# EasyEDA Pro project 生命体征.eprj

# Schematic Schematic1
Board Name: Board1; Create Date: 2025-03-21; Page Name: P1; Project Name: 生命体征; Schematic Name: Schematic1; Update Date: 2025-04-06; Company: 嘉立创EDA; Page Size: A4; Version: V1.0
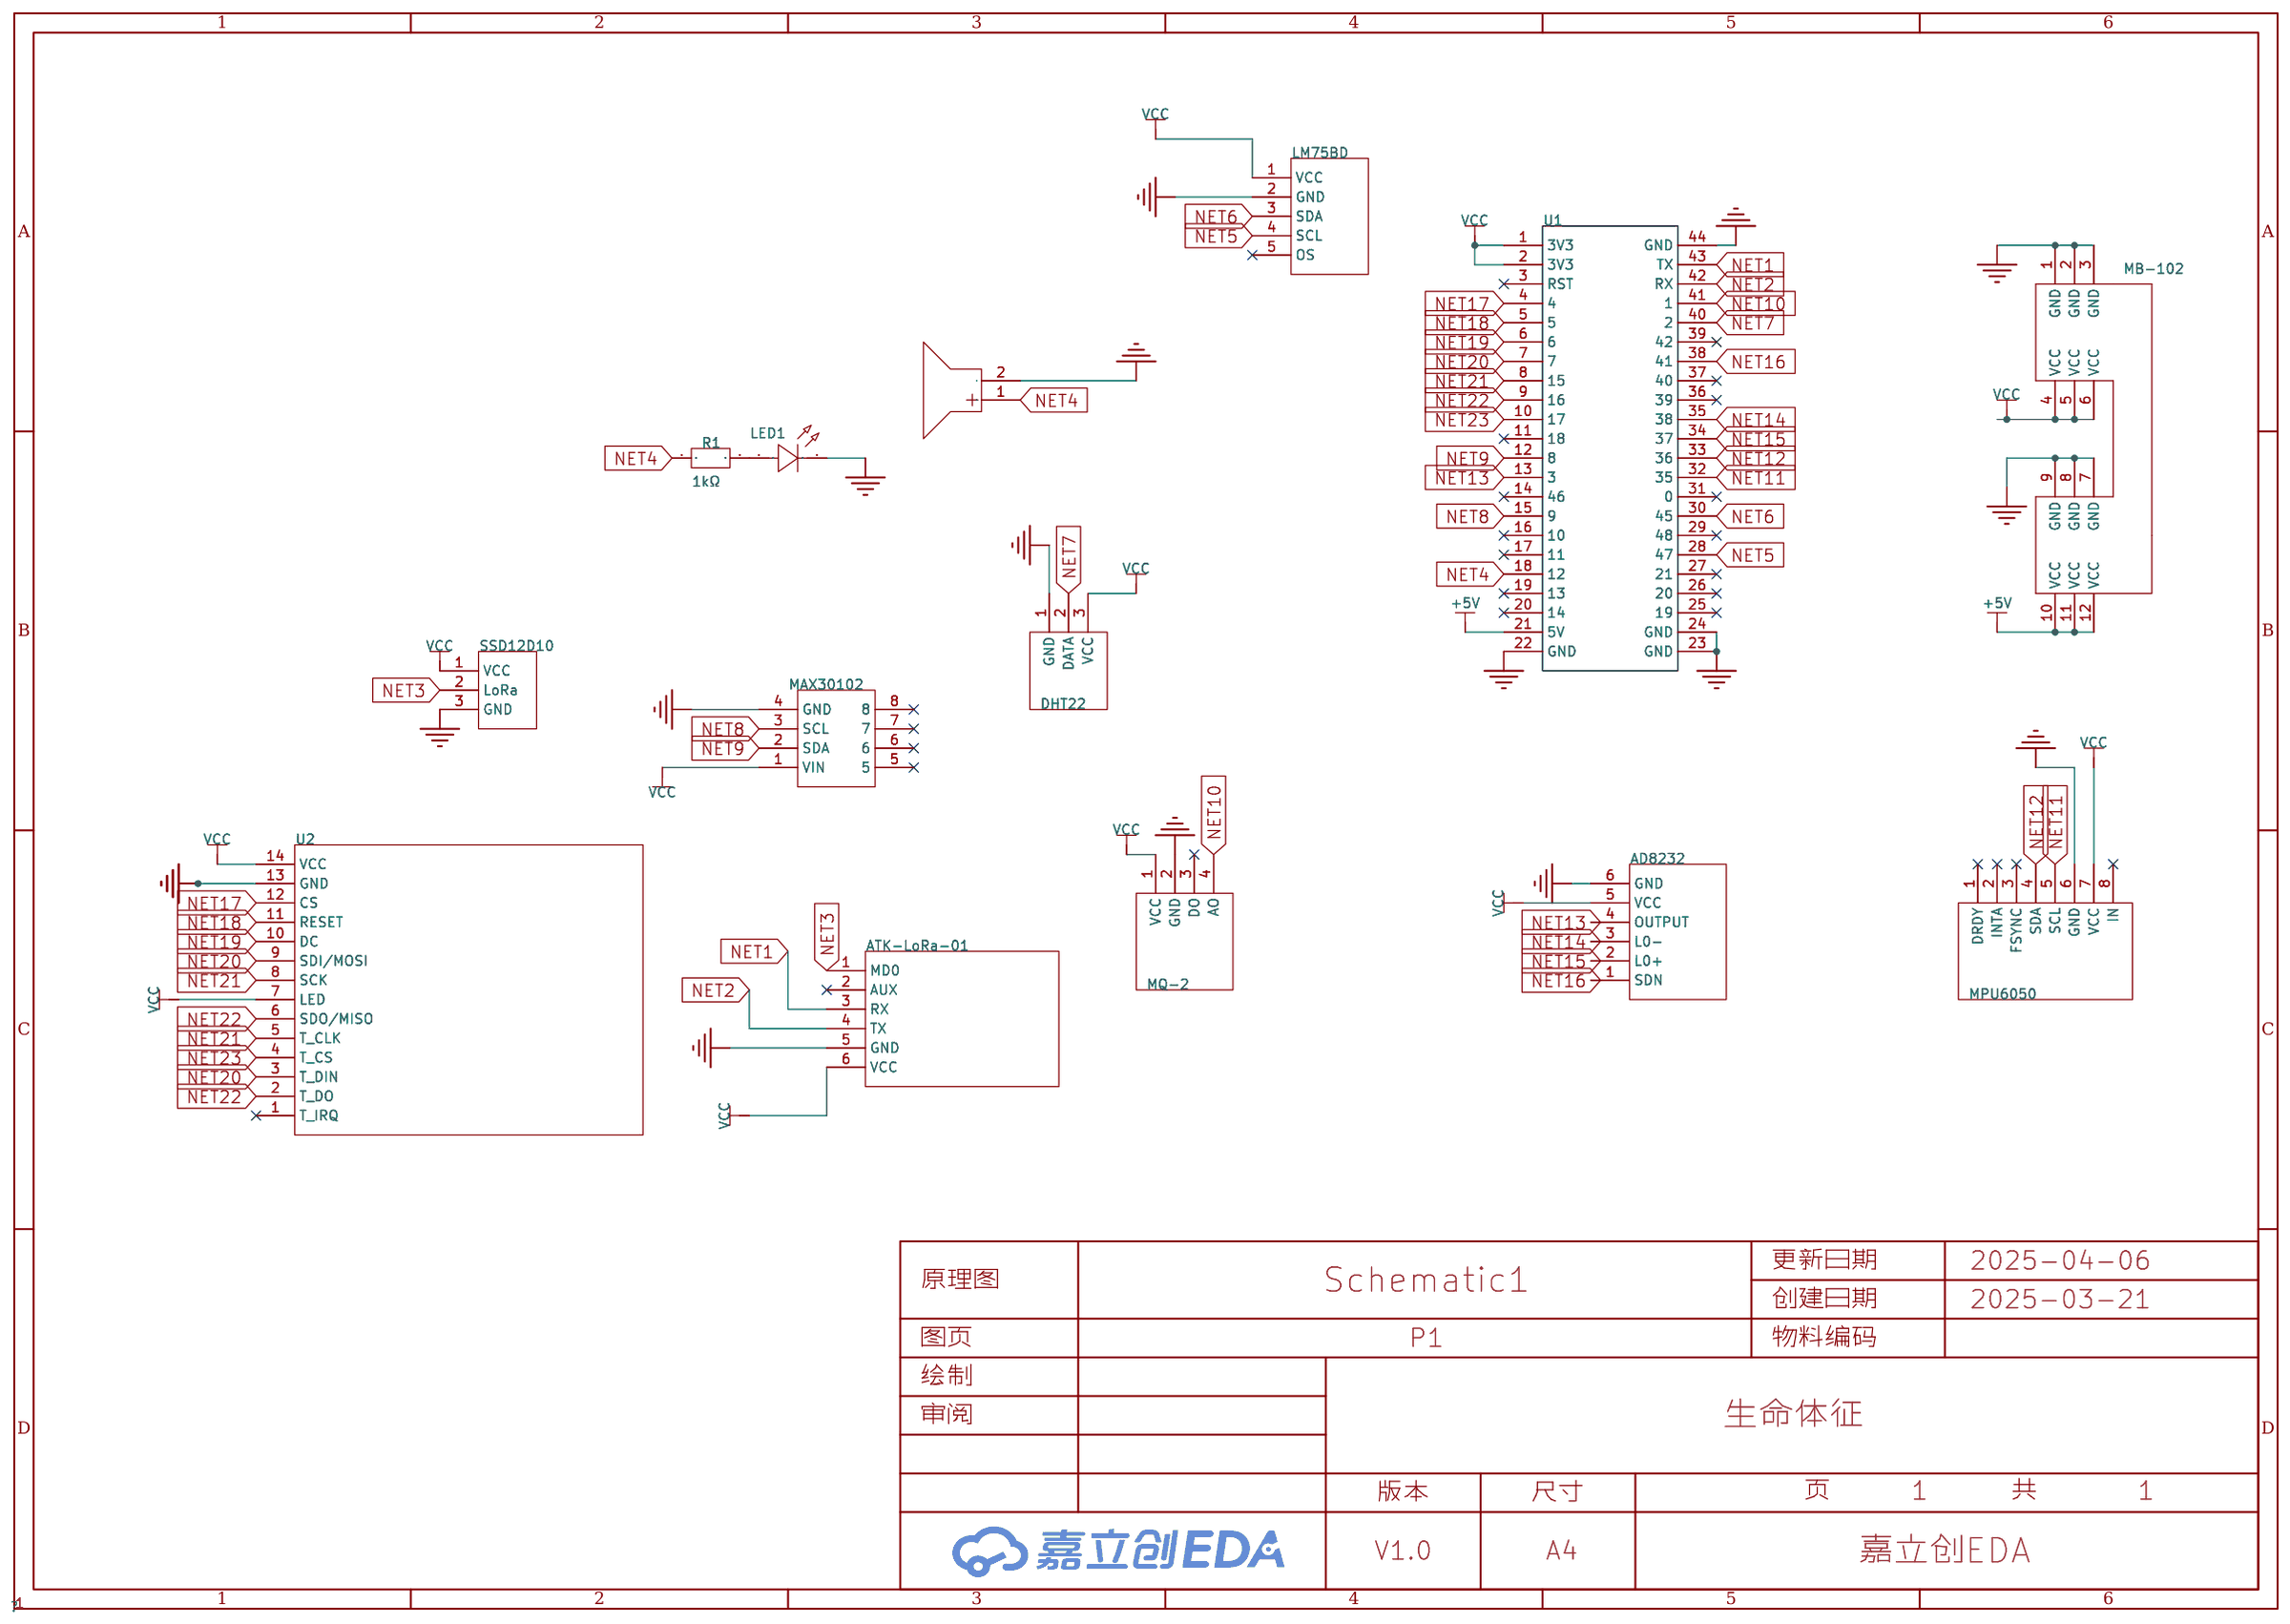
[diagram p0: schematic sheet]

## Parts
AD8232  -  [CONN-SMD_6P-P2.54_6P-2.54PH-2.0H-1.5]
ATK-LoRa-01  -  [ATK-LoRa-01]
DHT22  -  [HDR-TH_3P-P2.50_ZX-XH2.54-3PWZ]
LED1  L-7113SGC  [LED-TH_BD5.9-P2.54-FD]
LM75BD  -  [HDR-TH_5P-P2.54_220R-1-5P]
MAX30102  -  [CONN-TH_4P-P2.54_PH2.0MM-4P-24AWG]
MB-102  -  [MB-102]
MPU6050  -  [COMM-TH_MPU6050M]
MQ-2  -  [HDR-TH_4P-P2.00_SHOUHAN_2.0-4P-ZZDK]
R1  1kΩ  [RES-TH_BD2.7-L6.2-P10.20-D0.4]
SSD12D10  -  [CONN-TH_3P-P2.54_PG1.5-3P-2.5PH-7.0H-1.0T]
U1  -  [CONN-TH_ESP32-S3-DEVKITC-1U-N8_1]
U2  -  [COMM-TH_ILI9341]
有源蜂鸣器  有源蜂鸣器  [BUZ-TH_BD9.0-P5.00-D0.6-FD]

## Library data of the parts
AD8232 = AD8232
ATK-LoRa-01 = ATK-LoRa-01
DHT22 = DHT22
LED1 = L-7113SGC: Supplier Part: C598455; Manufacturer: Kingbright; Supplier Footprint: 插件; JLCPCB Part Class: Extended Part; Supplier: LCSC
LM75BD = LM75BD
MAX30102 = MAX30102
MB-102 = MB-102
MPU6050 = MPU6050
MQ-2 = MQ-2
R1 = MF1/4W-1K±1%-ST52: LCSC Part Name: 金属膜电阻 1kΩ ±1% 250mW; Supplier Part: C2903245; Manufacturer: VO(翔胜); Supplier Footprint: 插件,D2.7xL6.2mm; JLCPCB Part Class: Extended Part; Datasheet: https://atta.szlcsc.com/upload/public/pdf/source/20200609/C601728_5AA4C0C8E12E11069DA2C3356F29D1F2.pdf; Supplier: LCSC; Type: 金属膜电阻; Tolerance: ±1%; Overload Voltage (Max): 250V; Power(Watts): 250mW; Temperature Coefficient: ±100ppm/℃; Operating Temperature Range: -55℃~+155℃
SSD12D10 = SSD12D10
U1 = ESP32-S3 DevkitC-1
U2 = TFT_9341
有源蜂鸣器 = HNB09A03: LCSC Part Name: 电磁式有源一体蜂鸣器HNB09A03; Supplier Part: C96102; Manufacturer: 华能; Supplier Footprint: 插件,D=9mm; JLCPCB Part Class: Extended Part; Datasheet: https://atta.szlcsc.com/upload/public/pdf/source/20241128/61C4C8C3938BB25F7C38FBE94CCE8DCF.pdf; Supplier: LCSC; Driver Circuitry: 有源(内含驱动线路); Technology: 电磁式; Voltage - Supply: 1.5V~4.5V; Current Consumption: 30mA; Sound Pressure Level(SPL): 85dB; Diameter(φD): 9mm; Height: 5.5mm; Operating Temperature: -20℃~+70℃

## Nets
+5V: MB-102.10(VCC) MB-102.11(VCC) MB-102.12(VCC) U1.21(5V)
GND: AD8232.6(GND) ATK-LoRa-01.5(GND) DHT22.1(GND) LED1.2 LM75BD.2(GND) MAX30102.4(GND) MB-102.1(GND) MB-102.2(GND) MB-102.3(GND) MB-102.7(GND) MB-102.8(GND) MB-102.9(GND) MPU6050.6(GND) MQ-2.2(GND) SSD12D10.3(GND) U1.22(GND) U1.23(GND) U1.24(GND) U1.44(GND) U2.13(GND) 有源蜂鸣器.2(-)
VCC: AD8232.5(VCC) ATK-LoRa-01.6(VCC) DHT22.3(VCC) LM75BD.1(VCC) MAX30102.1(VIN) MB-102.4(VCC) MB-102.5(VCC) MB-102.6(VCC) MPU6050.7(VCC) MQ-2.1(VCC) SSD12D10.1(VCC) U1.1(3V3) U1.2(3V3) U2.7(LED) U2.14(VCC)
NET1: ATK-LoRa-01.3(RX) U1.43(TX)
NET2: ATK-LoRa-01.4(TX) U1.42(RX)
NET3: ATK-LoRa-01.1(MD0) SSD12D10.2(LoRa)
NET4: R1.1 U1.18(12) 有源蜂鸣器.1(+)
NET5: LM75BD.4(SCL) U1.28(47)
NET6: LM75BD.3(SDA) U1.30(45)
NET7: DHT22.2(DATA) U1.40(2)
NET8: MAX30102.3(SCL) U1.15(9)
NET9: MAX30102.2(SDA) U1.12(8)
NET10: MQ-2.4(AO) U1.41(1)
NET11: MPU6050.5(SCL) U1.32(35)
NET12: MPU6050.4(SDA) U1.33(36)
NET13: AD8232.4(OUTPUT) U1.13(3)
NET14: AD8232.3(L0-) U1.35(38)
NET15: AD8232.2(L0+) U1.34(37)
NET16: AD8232.1(SDN) U1.38(41)
NET17: U1.4 U2.12(CS)
NET18: U1.5 U2.11(RESET)
NET19: U1.6 U2.10(DC)
NET20: U1.7 U2.3(T_DIN) U2.9(SDI/MOSI)
NET21: U1.8(15) U2.5(T_CLK) U2.8(SCK)
NET22: U1.9(16) U2.2(T_DO) U2.6(SDO/MISO)
NET23: U1.10(17) U2.4(T_CS)
$1N4368: LED1.1 R1.2

Not connected (* = marked no-connect by the designer): ATK-LoRa-01 2(AUX)*; LM75BD 5(OS)*; MAX30102 5* 6* 7* 8*; MPU6050 1(DRDY)* 2(INTA)* 3(FSYNC)* 8(IN)*; MQ-2 3(DO)*; U1 3(RST)* 11(18)* 14(46)* 16(10)* 17(11)* 19(13)* 20(14)* 25(19)* 26(20)* 27(21)* 29(48)* 31(0)* 36(39)* 37(40)* 39(42)*; U2 1(T_IRQ)*

# Schematic Schematic2
Board Name: Board2; Create Date: 2025-03-23; Page Name: P1; Project Name: 生命体征; Schematic Name: Schematic2; Update Date: 2025-03-24; Company: 嘉立创EDA; Page Size: A4; Version: V1.0
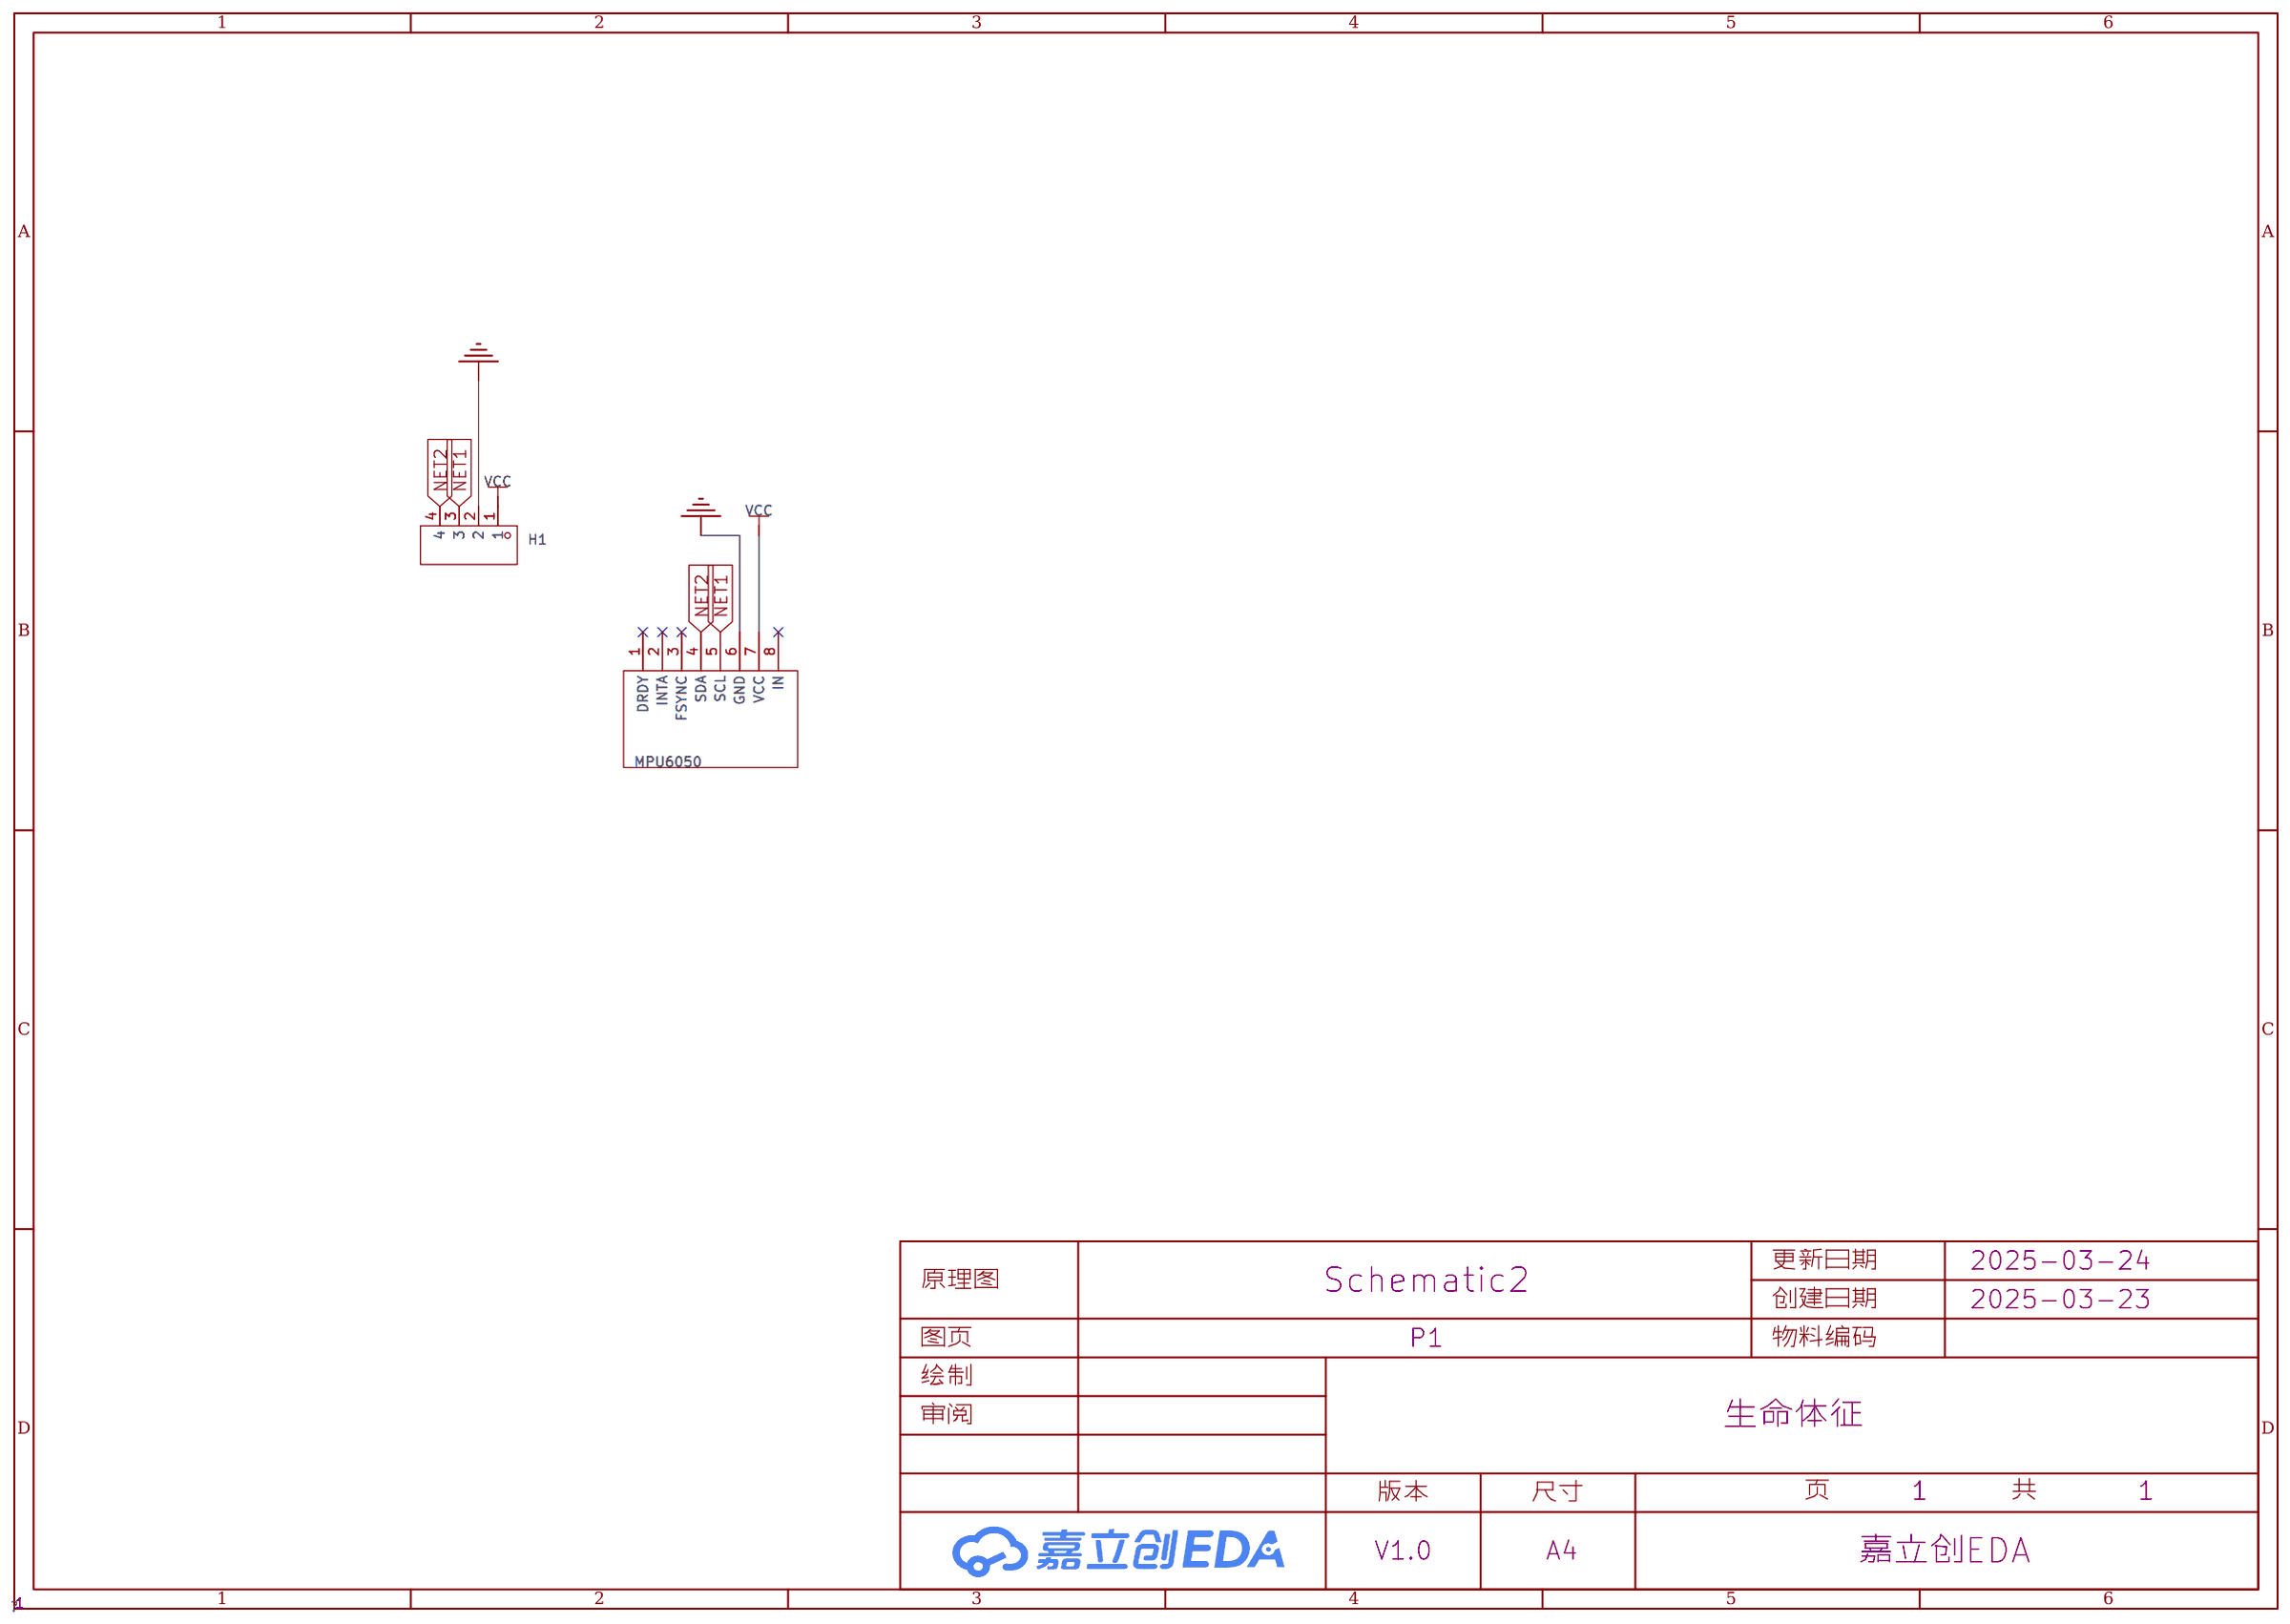
[diagram p1: schematic sheet]

## Parts
H1  HDR2.54-LI-2x4P  [HDR-TH_4P-P2.54-V-M]
MPU6050  -  [COMM-TH_MPU6050M]

## Library data of the parts
H1 = HDR2.54-LI-2x4P: Supplier Part: C9900020145; Supplier: LCSC
MPU6050 = MPU6050

## Nets
GND: H1.2 MPU6050.6(GND)
VCC: H1.1 MPU6050.7(VCC)
NET1: H1.3 MPU6050.5(SCL)
NET2: H1.4 MPU6050.4(SDA)

Not connected (* = marked no-connect by the designer): MPU6050 1(DRDY)* 2(INTA)* 3(FSYNC)* 8(IN)*

# Board PCB1
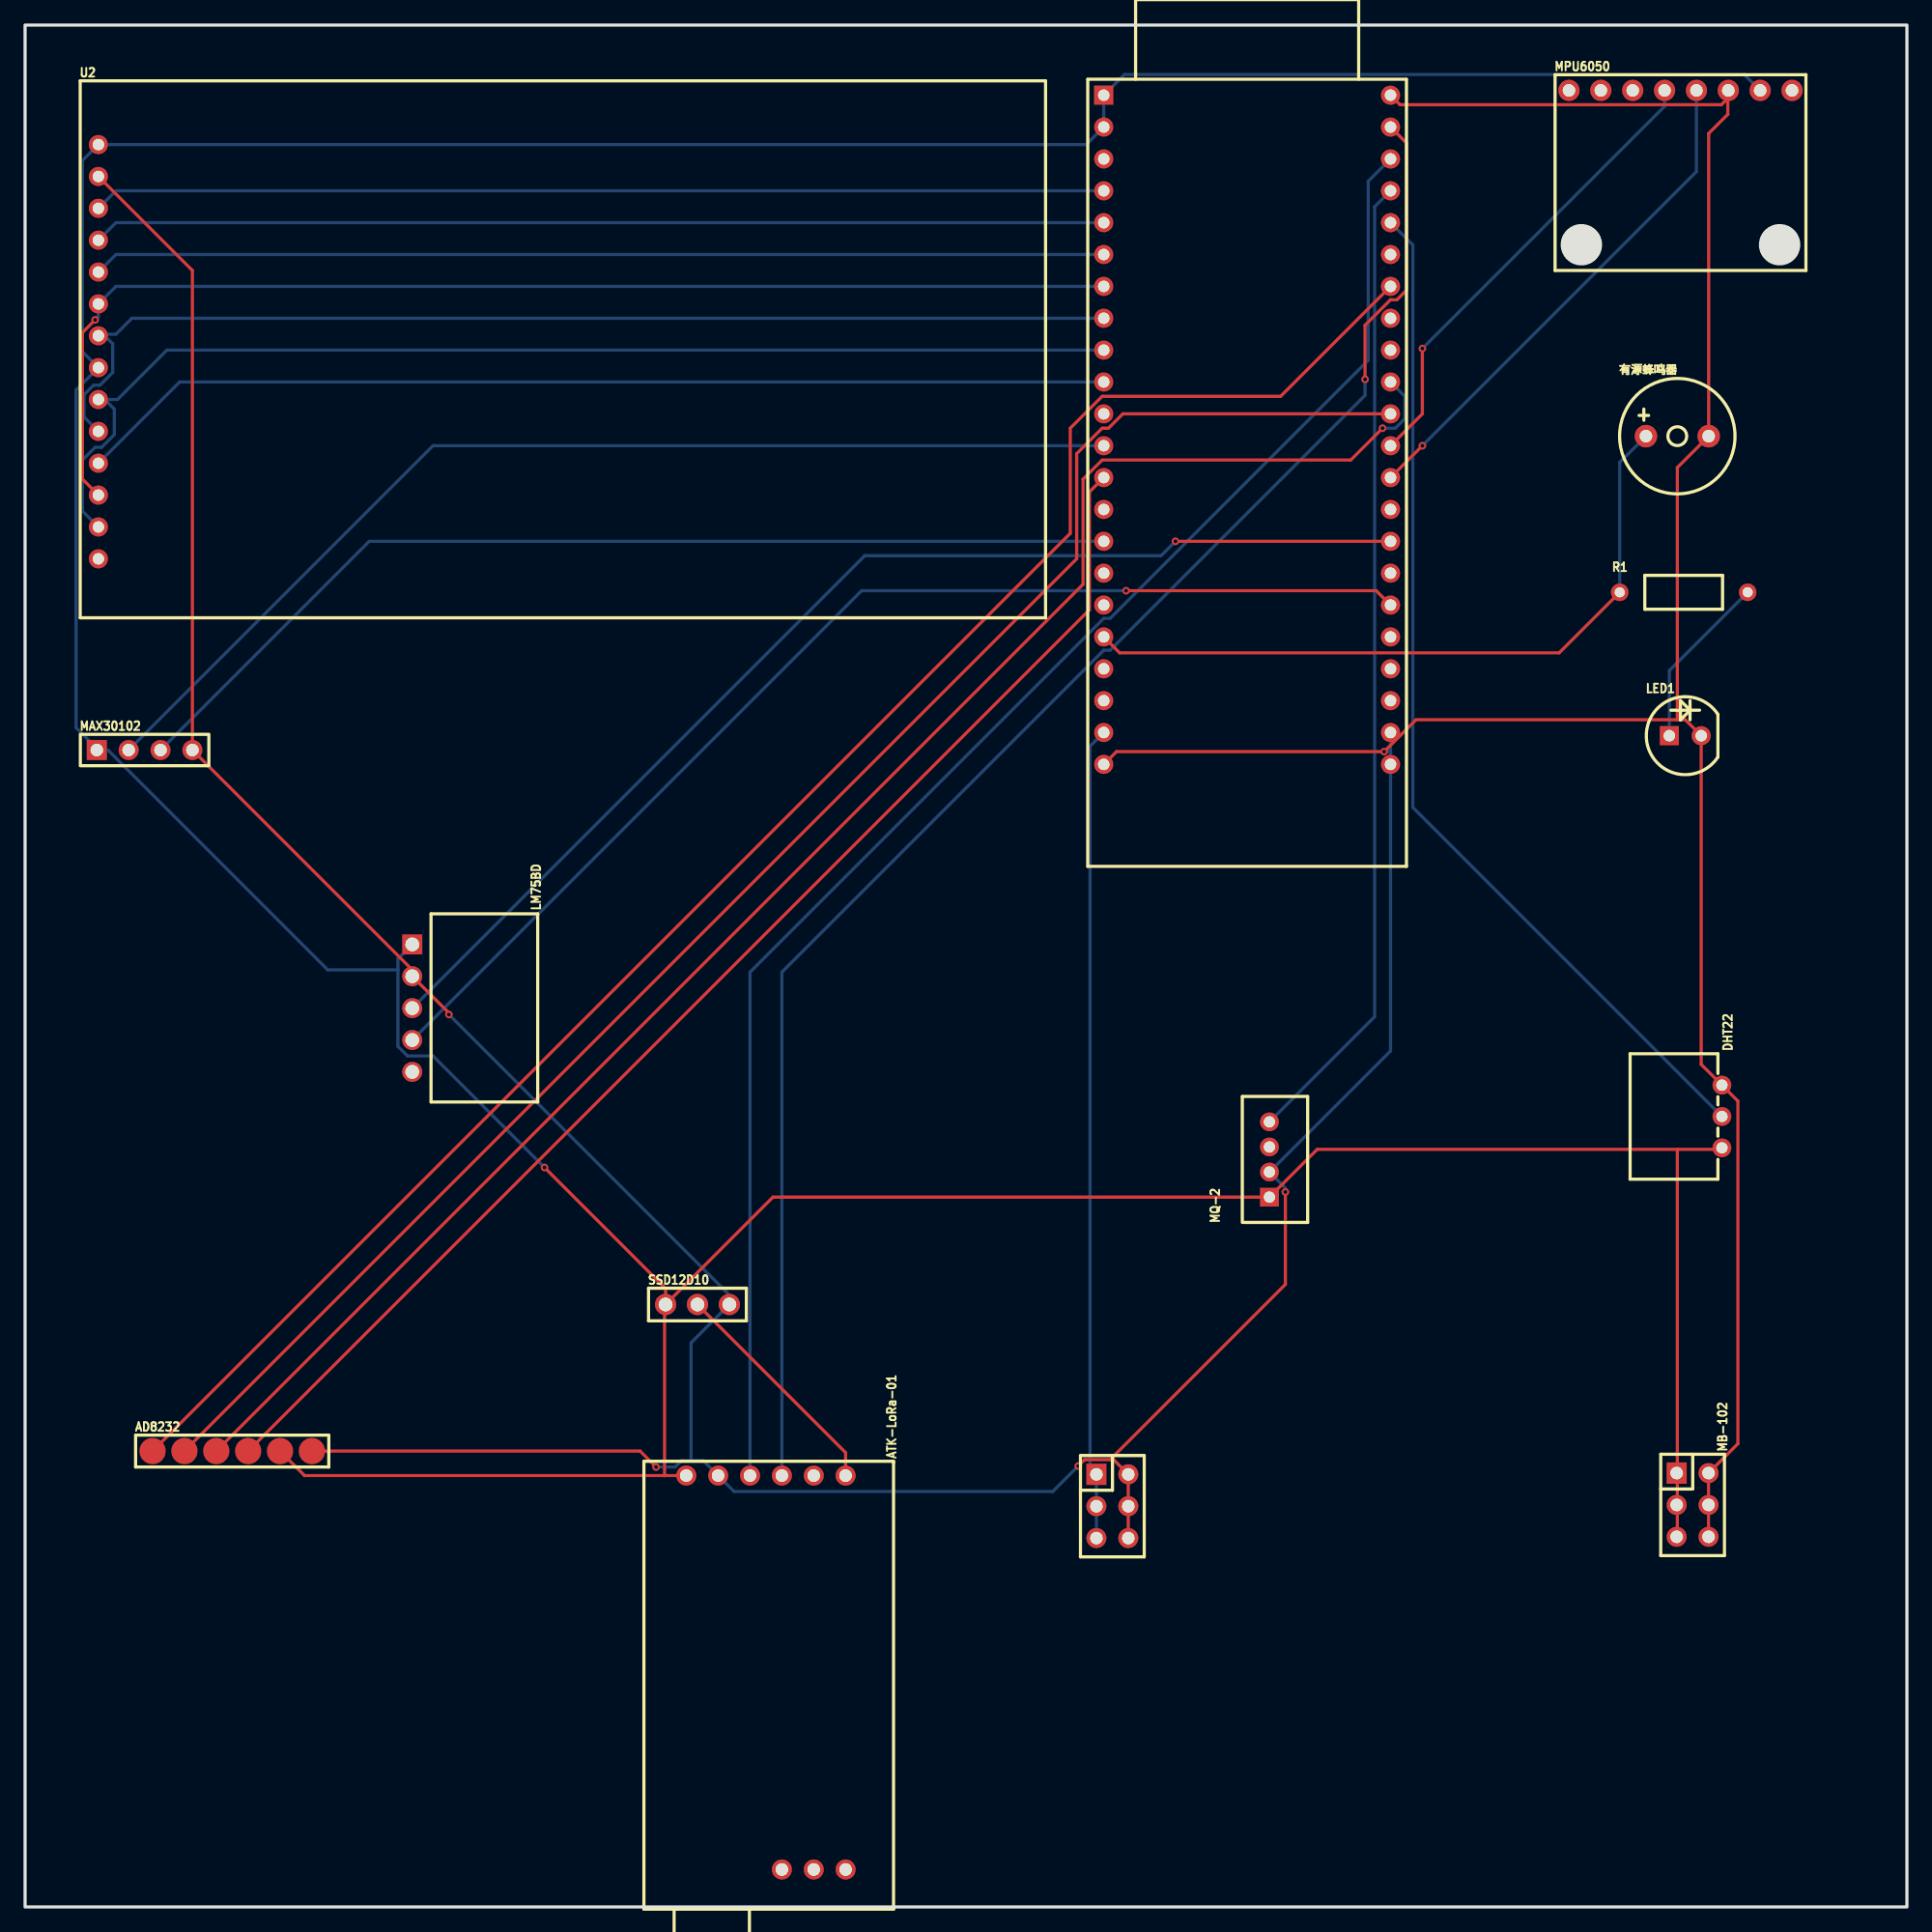
[diagram p2: board, top side]
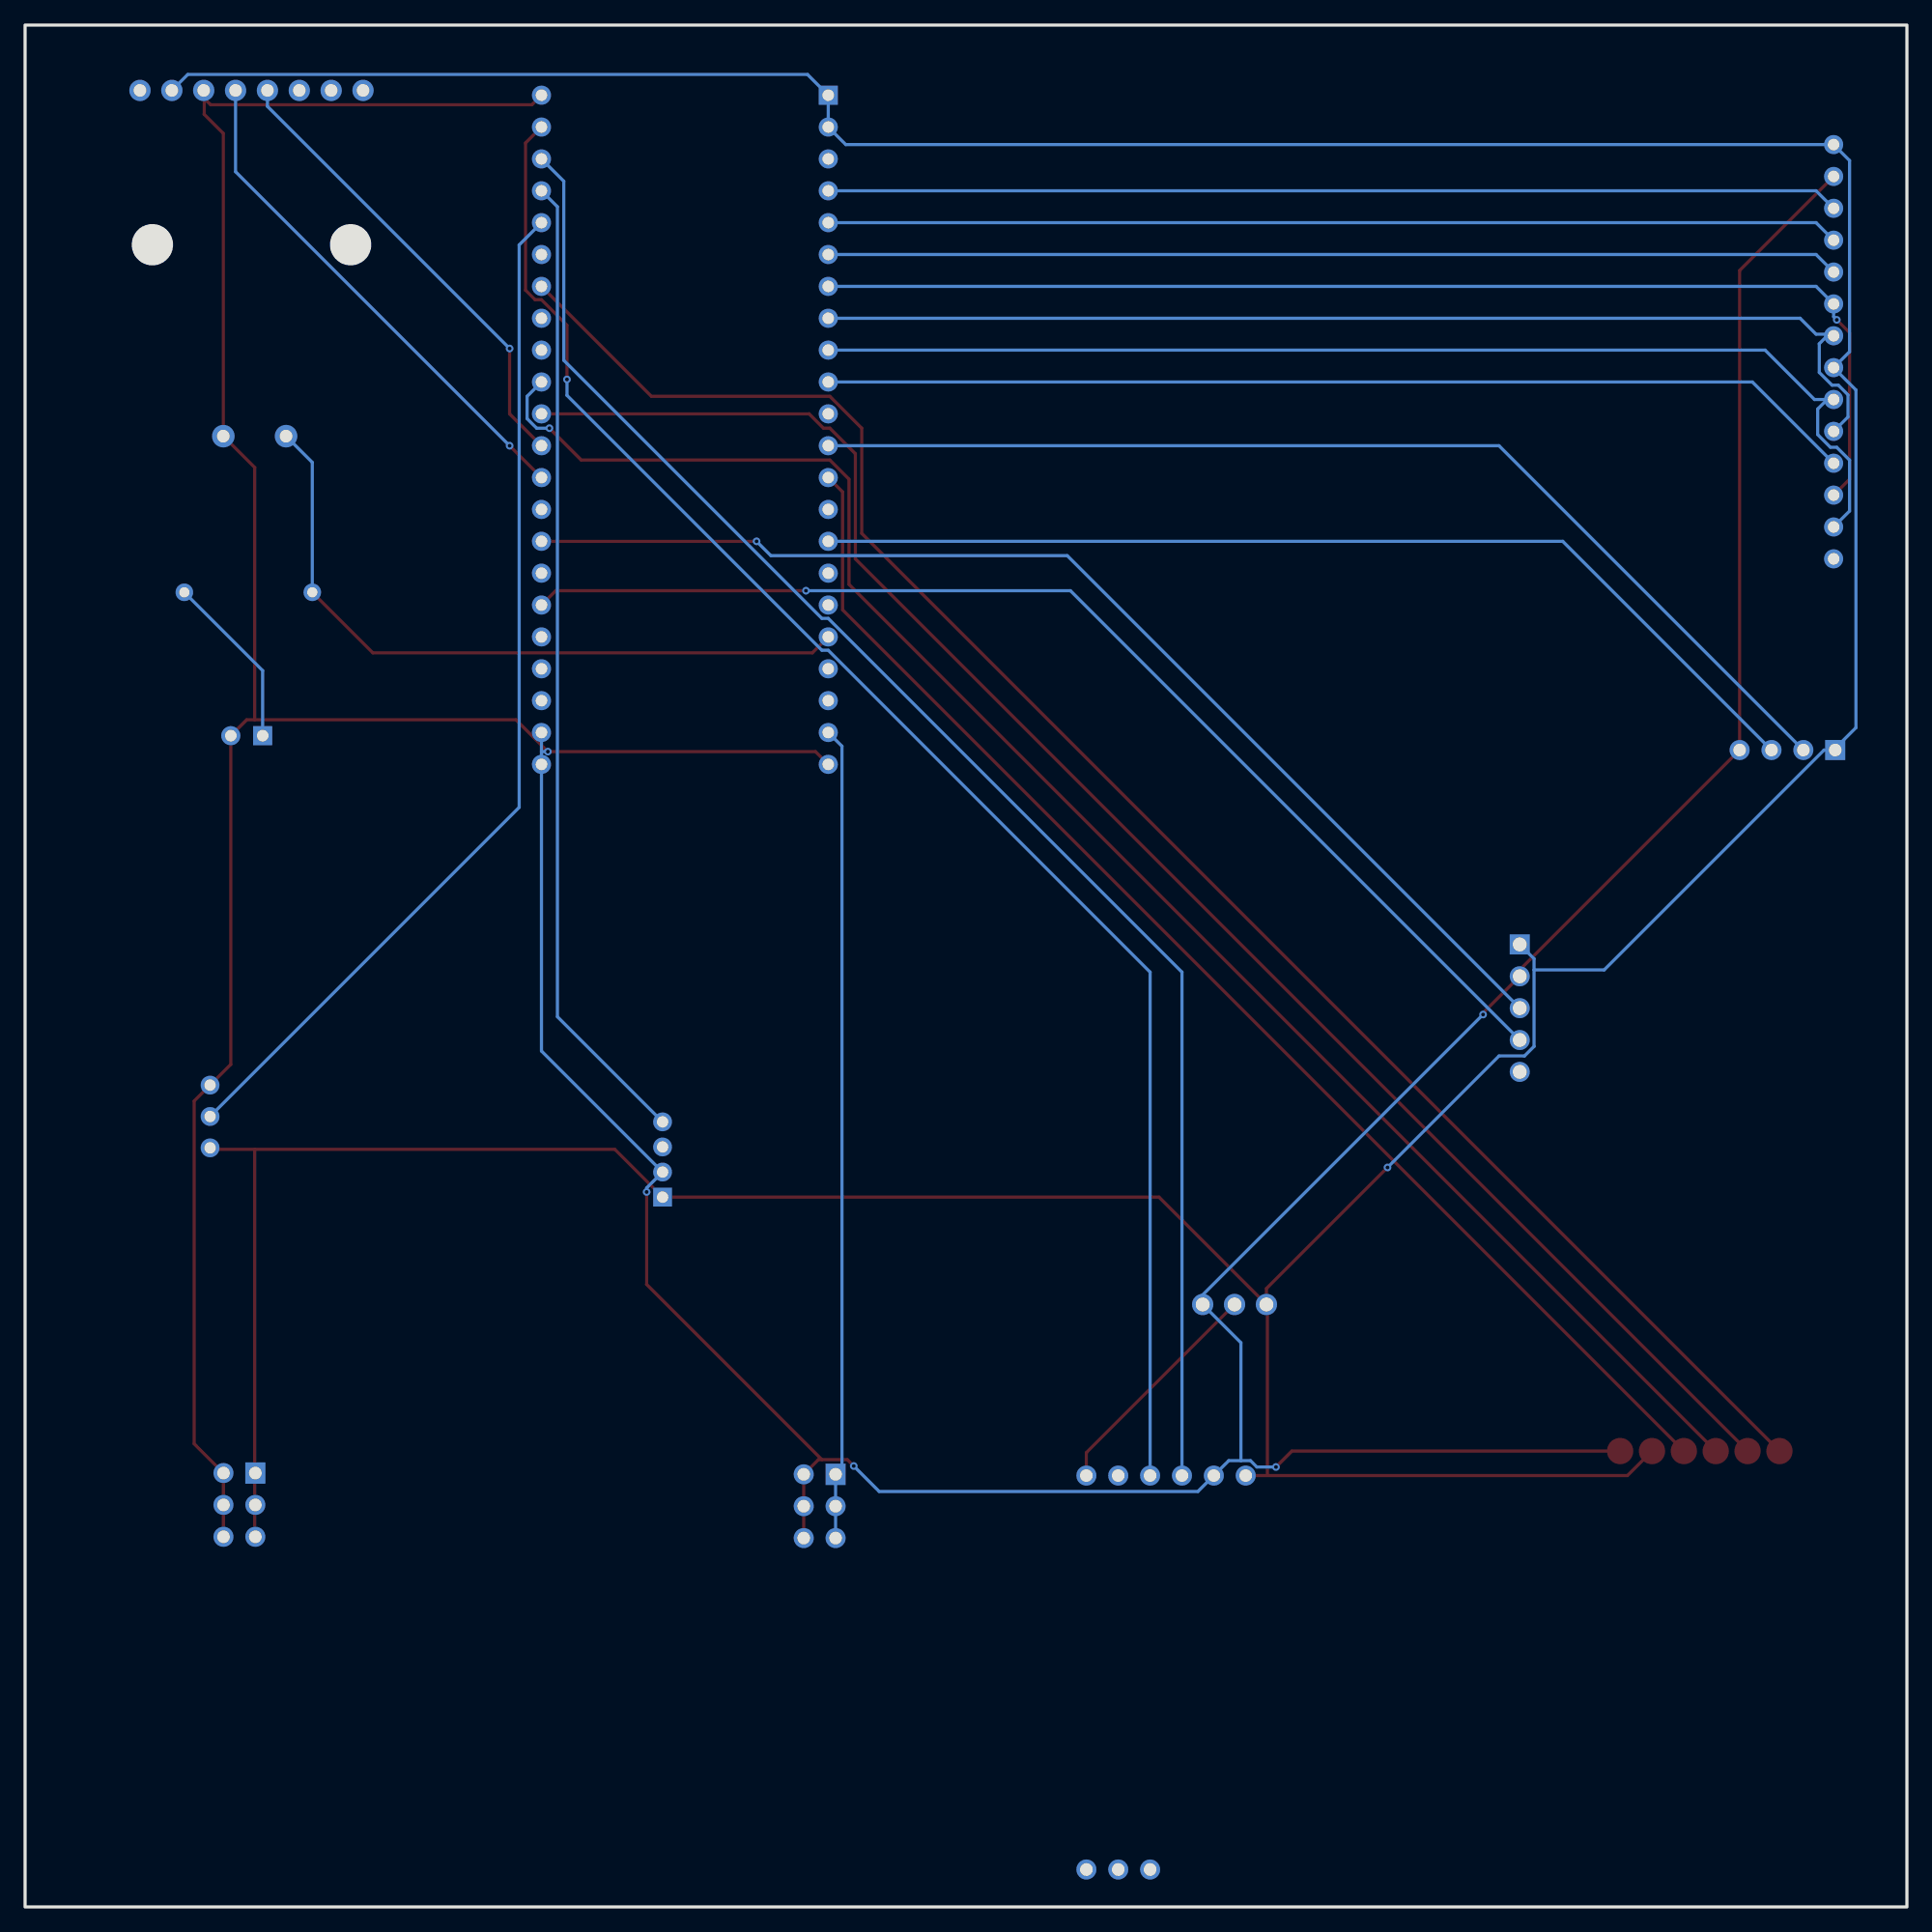
[diagram p3: board, bottom side, seen from below]

Outline 150 x 150 mm; copper layers: Top Layer, Bottom Layer. Coordinates in mm from the lower left corner of the outline.
Outline path: rectangle 0,150 150,0
Stack: Top Layer 0.035mm / Dielectric1 1.51mm FR4 er 4.5 / Bottom Layer 0.035mm

## Design rules (mm)
template: JLCPCB Capability(Two Layers Board)
spacing copperThickness1oz (default): track to track 0.102, other pairs 0.152 to 0.3
spacing copperThickness2oz: track to track 0.203, other pairs 0.152 to 0.3
track width copperThickness1oz (default): min 0.127, default 0.254, max 2.54
track width copperThickness2oz: min 0.203, default 0.254, max 2.54
differential pair differentialPair (default): width min 0.127, default 0.254, max 2.54; gap min 0.152, default 0.152
via viaSize (default): diameter min 0.5, default 0.61, max 10; hole min 0.3, default 0.305, max 6.3

## Placement (name value [footprint] x y rotation side)
AD8232  -  [CONN-SMD_6P-P2.54_6P-2.54PH-2.0H-1.5]  16.51 36.34 0 top
ATK-LoRa-01  -  [ATK-LoRa-01]  59.06 18.68 270 top
DHT22  -  [HDR-TH_3P-P2.50_ZX-XH2.54-3PWZ]  135.25 63 270 top
LED1  L-7113SGC  [LED-TH_BD5.9-P2.54-FD]  132.33 93.36 0 top
LM75BD  -  [HDR-TH_5P-P2.54_220R-1-5P]  30.86 71.64 270 top
MAX30102  -  [CONN-TH_4P-P2.54_PH2.0MM-4P-24AWG]  9.53 92.22 0 top
MB-102  -  [MB-102]  135.51 36.08 270 top
MPU6050  -  [COMM-TH_MPU6050M]  131.95 144.79 0 top
MQ-2  -  [HDR-TH_4P-P2.00_SHOUHAN_2.0-4P-ZZDK]  99.19 59.58 90 top
R1  1kΩ  [RES-TH_BD2.7-L6.2-P10.20-D0.4]  132.21 104.79 0 top
SSD12D10  -  [CONN-TH_3P-P2.54_PG1.5-3P-2.5PH-7.0H-1.0T]  53.59 48.02 0 top
U1  -  [CONN-TH_ESP32-S3-DEVKITC-1U-N8_1]  97.41 117.74 0 top
U2  -  [COMM-TH_ILI9341]  5.84 123.97 0 top
有源蜂鸣器  有源蜂鸣器  [BUZ-TH_BD9.0-P5.00-D0.6-FD]  131.7 117.23 0 top

## Footprints (pads in the part's own frame, mm; a bottom-side part is the same pattern mirrored in y, then rotated)
ATK-LoRa-01
  round 1.6 hole 1: 1(-15.7,6.35) 2(-15.7,3.81) 3(-15.7,1.27) 4(-15.7,-1.27) 5(-15.7,-3.81) 6(-15.7,-6.35) 7(15.7,6.35) 8(15.7,3.81) 9(15.7,1.27)
BUZ-TH_BD9.0-P5.00-D0.6-FD
  round 1.8 hole 1: 1(-2.5,0) 2(2.5,0)
COMM-TH_ILI9341
  round 1.524 hole 0.914: 1(0,-16.51) 2(0,-13.97) 3(0,-11.43) 4(0,-8.89) 5(0,-6.35) 6(0,-3.81) 7(0,-1.27) 8(0,1.27) 9(0,3.81) 10(0,6.35) 11(0,8.89) 12(0,11.43) 13(0,13.97) 14(0,16.51)
COMM-TH_MPU6050M
  round 1.7 hole 1: 1(-8.89,0) 2(-6.35,0) 3(-3.81,0) 4(-1.27,0) 5(1.27,0) 6(3.81,0) 7(6.35,0) 8(8.89,0)
CONN-SMD_6P-P2.54_6P-2.54PH-2.0H-1.5
  round 2.1 smd: 1(-6.35,0) 2(-3.81,0) 3(-1.27,0) 4(1.27,0) 5(3.81,0) 6(6.35,0)
CONN-TH_3P-P2.54_PG1.5-3P-2.5PH-7.0H-1.0T
  round 1.7 hole 1.1: 1(-2.54,0) 2(0,0) 3(2.54,0)
CONN-TH_4P-P2.54_PH2.0MM-4P-24AWG
  rect 1.6x1.6 hole 1: 1(-3.81,0)
  round 1.6 hole 1: 2(-1.27,0) 3(1.27,0) 4(3.81,0)
CONN-TH_ESP32-S3-DEVKITC-1U-N8_1
  rect 1.524x1.524 hole 0.914: 1(-11.43,26.67)
  round 1.524 hole 0.914: 2(-11.43,24.13) 3(-11.43,21.59) 4(-11.43,19.05) 5(-11.43,16.51) 6(-11.43,13.97) 7(-11.43,11.43) 8(-11.43,8.89) 9(-11.43,6.35) 10(-11.43,3.81) 11(-11.43,1.27) 12(-11.43,-1.27) 13(-11.43,-3.81) 14(-11.43,-6.35) 15(-11.43,-8.89) 16(-11.43,-11.43) 17(-11.43,-13.97) 18(-11.43,-16.51) 19(-11.43,-19.05) 20(-11.43,-21.59) 21(-11.43,-24.13) 22(-11.43,-26.67) 23(11.43,-26.67) 24(11.43,-24.13) 25(11.43,-21.59) 26(11.43,-19.05) 27(11.43,-16.51) 28(11.43,-13.97) 29(11.43,-11.43) 30(11.43,-8.89) 31(11.43,-6.35) 32(11.43,-3.81) 33(11.43,-1.27) 34(11.43,1.27) 35(11.43,3.81) 36(11.43,6.35) 37(11.43,8.89) 38(11.43,11.43) 39(11.43,13.97) 40(11.43,16.51) 41(11.43,19.05) 42(11.43,21.59) 43(11.43,24.13) 44(11.43,26.67)
HDR-TH_3P-P2.50_ZX-XH2.54-3PWZ
  round 1.5 hole 0.9: 1(-2.5,0) 2(0,0) 3(2.5,0)
HDR-TH_4P-P2.00_SHOUHAN_2.0-4P-ZZDK
  rect 1.5x1.5 hole 0.9: 1(-3,0)
  round 1.5 hole 0.9: 2(-1,0) 3(1,0) 4(3,0)
HDR-TH_5P-P2.54_220R-1-5P
  rect 1.6x1.6 hole 1.1: 1(-5.08,0)
  round 1.6 hole 1.1: 2(-2.54,0) 3(0,0) 4(2.54,0) 5(5.08,0)
LED-TH_BD5.9-P2.54-FD
  rect 1.524x1.524 hole 0.914: 1(-1.27,0)
  round 1.524 hole 0.914: 2(1.27,0)
MB-102
  round 1.6 hole 1: 1(1.498,-1.321) 2(4.038,-1.321) 3(6.579,-1.321) 5(4.038,-3.861) 6(6.579,-3.861) 7(6.68,-47.574) 8(4.14,-47.574) 9(1.6,-47.574) 11(4.14,-50.114) 12(6.68,-50.114)
  rect 1.7x1.6 hole 1: 4(1.498,-3.861) 10(1.6,-50.114)
RES-TH_BD2.7-L6.2-P10.20-D0.4
  round 1.4 hole 0.8: 1(-5.1,0) 2(5.1,0)

## Nets
As in the schematic.

Pads without a net: ATK-LoRa-01 2 7 8 9; LM75BD 5; MPU6050 1 2 3 8; MQ-2 3; U1 3 11 14 16 17 19 20 25 26 27 29 31 36 37 39; U2 1

## Via types
v1: diameter 0.61, hole 0.305, Top Layer to Bottom Layer, 13 vias

## Routing (per net, layer and track width the routed paths; a pad name or vN(x,y) marks a point on that pad's centre or on a via; arc(x,y) is an arc through that point)
+5V: length 64.9
  Bottom Layer w0.254: 85.4,29.4 85.4,34.48 84.89,34.99 84.89,92.52 85.98,93.61
GND: length 461.6
  Top Layer w0.254: v1(50.29,35.06) 49.02,36.34 AD8232.6 ; MPU6050.6 135.72,144.75 135.72,144.16 ; 86.49,35.65 100.46,49.62 v1(100.46,56.99) ; 86.49,35.65 84.46,35.65 v1(83.95,35.14) ; 86.49,35.65 86.76,35.65 MB-102.9 MB-102.8 MB-102.7 ; 135.72,144.16 135.22,143.65 109.6,143.65 U1.44 ; 135.72,144.16 135.72,142.89 134.2,141.36 有源蜂鸣器.2 131.7,114.73 131.7,94.63 ; 131.7,94.63 132.33,94.63 LED1.2 133.6,67.16 DHT22.1 136.53,64.23 136.53,36.92 MB-102.1 MB-102.2 MB-102.3 ; 131.7,94.63 110.87,94.63 v1(108.33,92.09) 87,92.09 85.98,91.07 ; v1(33.78,71.13) 33.78,71.26 30.86,74.18 30.86,74.69 MAX30102.4 13.33,130.44 U2.13
  Bottom Layer w0.254: 53.09,35.57 53.09,44.97 SSD12D10.3 56.13,48.78 v1(33.78,71.13) ; 53.09,35.57 54.05,35.57 ATK-LoRa-01.5 56.52,33.11 81.91,33.11 v1(83.95,35.14) ; 53.09,35.57 52.32,35.57 51.82,35.06 v1(50.29,35.06) ; v1(100.46,56.99) 100.46,57.31 MQ-2.2 108.84,68.23 U1.23 108.84,92.09 ; 108.84,92.09 U1.24 ; 108.84,92.09 v1(108.33,92.09)
VCC: length 425.4
  Top Layer w0.254: AD8232.5 22.27,34.38 50.97,34.38 ; 131.7,31.94 MB-102.5 ; 131.7,31.94 131.7,29.55 MB-102.6 ; 131.7,31.94 131.7,34.48 ; 131.7,60.39 131.7,34.48 ; 131.7,60.39 103,60.39 MQ-2.1 59.61,56.58 SSD12D10.1 ; 131.7,60.39 135.14,60.39 DHT22.3 ; 131.7,34.48 MB-102.4 ; SSD12D10.1 51.05,49.29 v1(41.4,58.94) ; SSD12D10.1 50.97,47.94 50.97,34.38 ; 50.97,34.38 52.7,34.38
  Bottom Layer w0.254: v1(41.4,58.94) 32.51,67.83 30.48,67.83 29.72,68.59 29.72,74.69 ; 29.72,74.69 29.72,75.58 LM75BD.1 ; 29.72,74.69 24.13,74.69 6.6,92.22 5.84,92.22 ; 5.84,92.22 MAX30102.1 ; 5.84,92.22 4.06,93.99 4.06,120.92 U2.7 4.57,123.97 4.57,139.2 U2.14 84.58,140.47 85.98,141.87 85.98,144.41 87.63,146.06 137.03,146.06 MPU6050.7
NET1: length 129.2
  Top Layer w0.254: v1(106.81,121.76) 106.81,126.08 108.84,128.11 109.35,128.11 110.11,128.87 110.11,140.6 U1.43
  Bottom Layer w0.254: 60.32,34.38 60.32,74.51 85.98,100.17 86.49,100.17 106.81,120.49 v1(106.81,121.76)
NET2: length 126.4
  Bottom Layer w0.254: 57.78,34.38 57.78,74.51 85.98,102.71 86.49,102.71 107.06,123.28 107.06,137.55 U1.42
NET3: length 18.5
  Top Layer w0.254: SSD12D10.2 65.41,36.21 ATK-LoRa-01.1
NET4: length 57
  Top Layer w0.254: R1.1 122.28,99.96 87.25,99.96 85.98,101.23
  Bottom Layer w0.254: 有源蜂鸣器.1 127.11,115.14 R1.1
NET5: length 93.3
  Top Layer w0.254: U1.28 107.7,104.92 v1(87.76,104.92)
  Bottom Layer w0.254: LM75BD.4 66.68,104.92 v1(87.76,104.92)
NET6: length 93.4
  Top Layer w0.254: v1(91.69,108.85) U1.30
  Bottom Layer w0.254: v1(91.69,108.85) 90.55,107.71 66.93,107.71 LM75BD.3
NET7: length 82.2
  Bottom Layer w0.254: DHT22.2 110.62,87.64 110.62,132.47 U1.40
NET8: length 82.1
  Bottom Layer w0.254: 85.98,108.85 27.43,108.85 MAX30102.3
NET9: length 87.8
  Bottom Layer w0.254: MAX30102.2 32.51,116.47 85.98,116.47
NET10: length 78.2
  Bottom Layer w0.254: U1.41 107.57,135.52 107.57,70.96 MQ-2.4
NET11: length 41
  Top Layer w0.254: v1(111.38,116.47) U1.32
  Bottom Layer w0.254: MPU6050.5 133.22,138.32 v1(111.38,116.47)
NET12: length 37.4
  Top Layer w0.254: U1.33 111.38,119.01 v1(111.38,124.22)
  Bottom Layer w0.254: v1(111.38,124.22) 130.68,143.52 MPU6050.4
NET13: length 105.8
  Top Layer w0.254: AD8232.4 84.84,103.39 84.84,112.79 85.98,113.93
NET14: length 137.1
  Top Layer w0.254: v1(108.2,117.87) 105.66,115.33 85.85,115.33 84.33,113.81 84.33,105.42 AD8232.3
  Bottom Layer w0.254: U1.35 109.98,120.41 109.98,118.63 109.22,117.87 v1(108.2,117.87)
NET15: length 135.3
  Top Layer w0.254: AD8232.2 83.82,107.45 83.82,115.84 85.85,117.87 86.36,117.87 87.5,119.01 U1.34
NET16: length 142
  Top Layer w0.254: AD8232.1 83.31,109.49 83.31,117.87 85.85,120.41 100.08,120.41 U1.38
NET17: length 80.7
  Bottom Layer w0.254: 85.98,136.79 7.24,136.79 U2.12
NET18: length 80.7
  Bottom Layer w0.254: 85.98,134.25 7.24,134.25 U2.11
NET19: length 80.7
  Bottom Layer w0.254: U2.10 7.24,131.71 85.98,131.71
NET20: length 97
  Top Layer w0.254: v1(5.59,126.5) 4.57,125.49 4.57,113.81 U2.3
  Bottom Layer w0.254: v1(5.59,126.5) 5.84,126.76 U2.9 7.24,129.17 85.98,129.17
NET21: length 90.5
  Bottom Layer w0.254: U2.8 5.97,125.36 6.22,125.36 ; 6.22,125.36 6.98,124.6 6.98,122.31 5.97,121.3 5.46,121.3 4.7,120.54 4.7,118.76 U2.5 ; 6.22,125.36 7.24,125.36 8.51,126.63 85.98,126.63
NET22: length 94.1
  Bottom Layer w0.254: U2.2 4.57,111.27 4.57,115.33 5.59,116.34 6.1,116.34 7.11,117.36 7.11,119.39 6.35,120.16 ; 6.35,120.16 7.37,120.16 11.3,124.09 85.98,124.09 ; 6.35,120.16 U2.6
NET23: length 82.8
  Bottom Layer w0.254: 85.98,121.55 12.32,121.55 U2.4
$1N4368: length 14
  Bottom Layer w0.254: R1.2 131.06,98.55 LED1.1

# Board PCB2
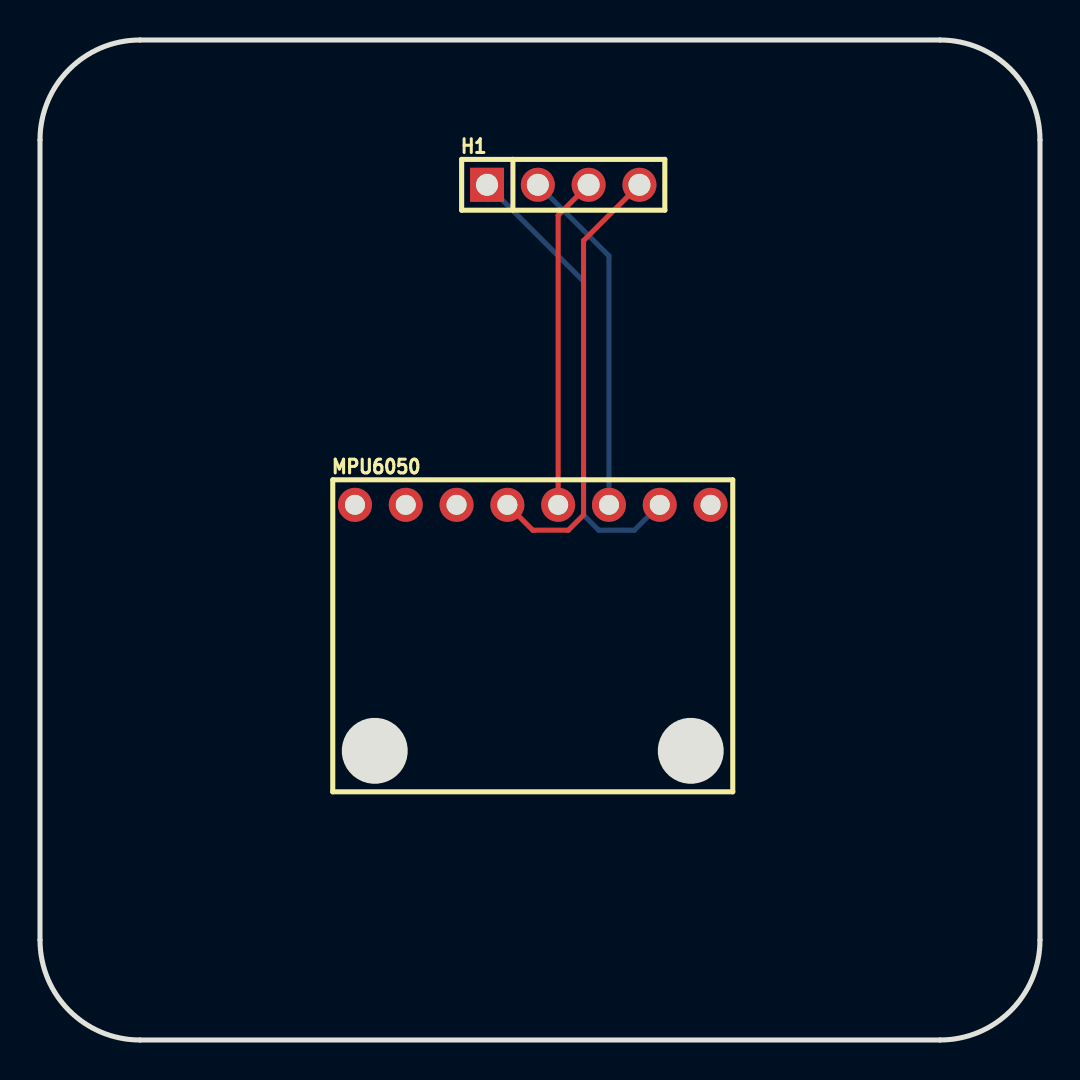
[diagram p4: board, top side]
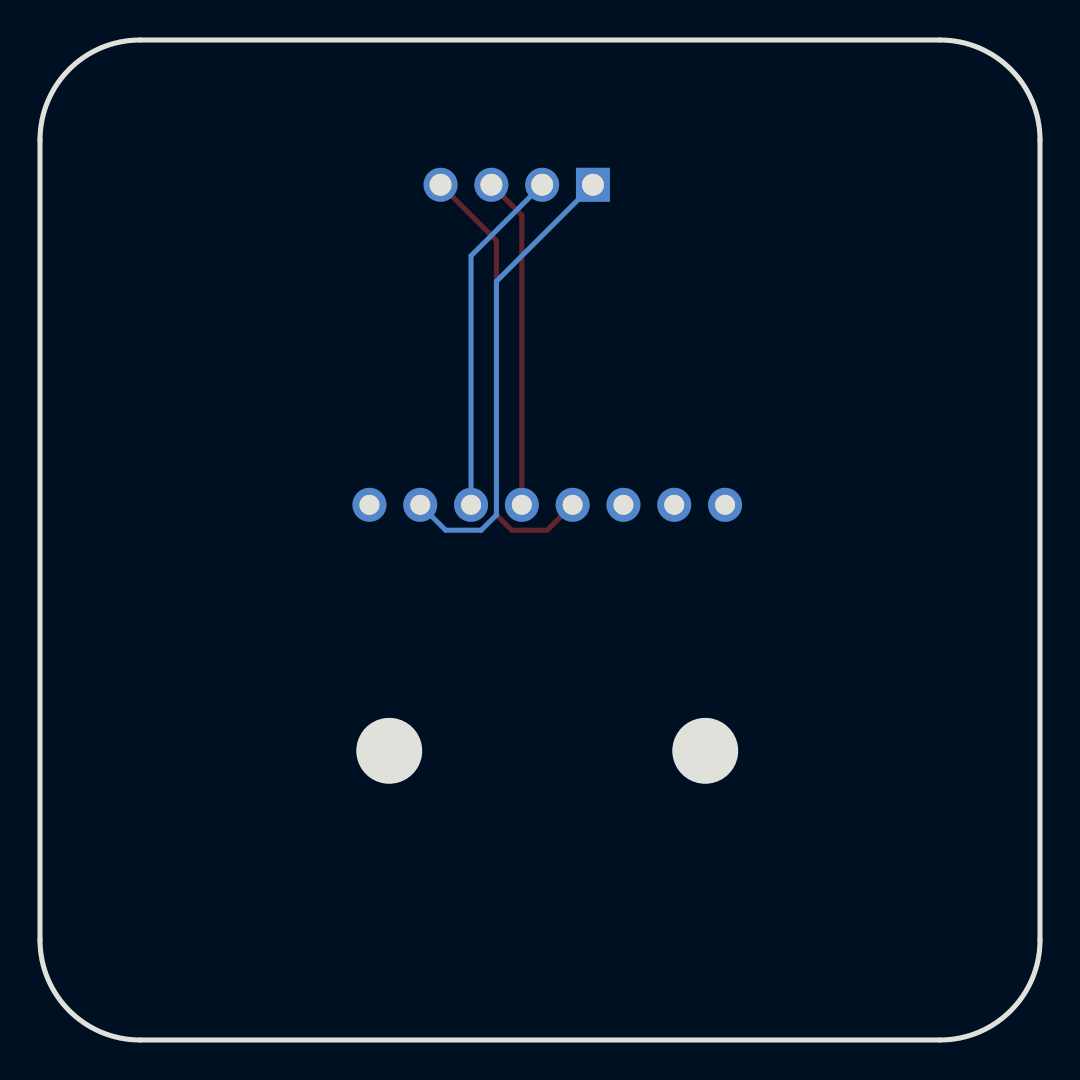
[diagram p5: board, bottom side, seen from below]

Outline 50 x 50 mm; copper layers: Top Layer, Bottom Layer. Coordinates in mm from the lower left corner of the outline.
Outline path: 0,45 0,5 arc(1.46,1.46) 5,0 45,0 arc(48.54,1.46) 50,5 50,45 arc(48.54,48.54) 45,50 5,50 arc(1.46,48.54) 0,45
Stack: Top Layer 0.035mm / Dielectric1 1.51mm FR4 er 4.5 / Bottom Layer 0.035mm

## Design rules (mm)
template: JLCPCB Capability(Two Layers Board)
spacing copperThickness1oz (default): track to track 0.102, other pairs 0.152 to 0.3
spacing copperThickness2oz: track to track 0.203, other pairs 0.152 to 0.3
track width copperThickness1oz (default): min 0.127, default 0.254, max 2.54
track width copperThickness2oz: min 0.203, default 0.254, max 2.54
differential pair differentialPair (default): width min 0.127, default 0.254, max 2.54; gap min 0.152, default 0.152
via viaSize (default): diameter min 0.5, default 0.61, max 10; hole min 0.3, default 0.305, max 6.3

## Placement (name value [footprint] x y rotation side)
H1  HDR2.54-LI-2x4P  [HDR-TH_4P-P2.54-V-M]  26.16 42.76 0 top
MPU6050  -  [COMM-TH_MPU6050M]  24.64 26.76 0 top

## Footprints (pads in the part's own frame, mm; a bottom-side part is the same pattern mirrored in y, then rotated)
COMM-TH_MPU6050M
  round 1.7 hole 1: 1(-8.89,0) 2(-6.35,0) 3(-3.81,0) 4(-1.27,0) 5(1.27,0) 6(3.81,0) 7(6.35,0) 8(8.89,0)
HDR-TH_4P-P2.54-V-M
  rect 1.7x1.7 hole 1.1: 1(-3.81,0)
  round 1.7 hole 1.1: 2(-1.27,0) 3(1.27,0) 4(3.81,0)

## Nets
As in the schematic.

Pads without a net: MPU6050 1 2 3 8

## Routing (per net, layer and track width the routed paths; a pad name or vN(x,y) marks a point on that pad's centre or on a via; arc(x,y) is an arc through that point)
GND: length 17.5
  Bottom Layer w0.254: MPU6050.6 28.45,39.2 H1.2
VCC: length 23.2
  Bottom Layer w0.254: H1.1 27.18,37.94 27.18,26.25 27.94,25.49 29.72,25.49 MPU6050.7
NET1: length 16.6
  Top Layer w0.254: H1.3 25.91,41.24 MPU6050.5
NET2: length 22.3
  Top Layer w0.254: H1.4 27.18,39.97 27.18,26.25 26.42,25.49 24.64,25.49 MPU6050.4
